# EAGLE design Nexmonitor Invasivo (EAGLE 9.5.0)
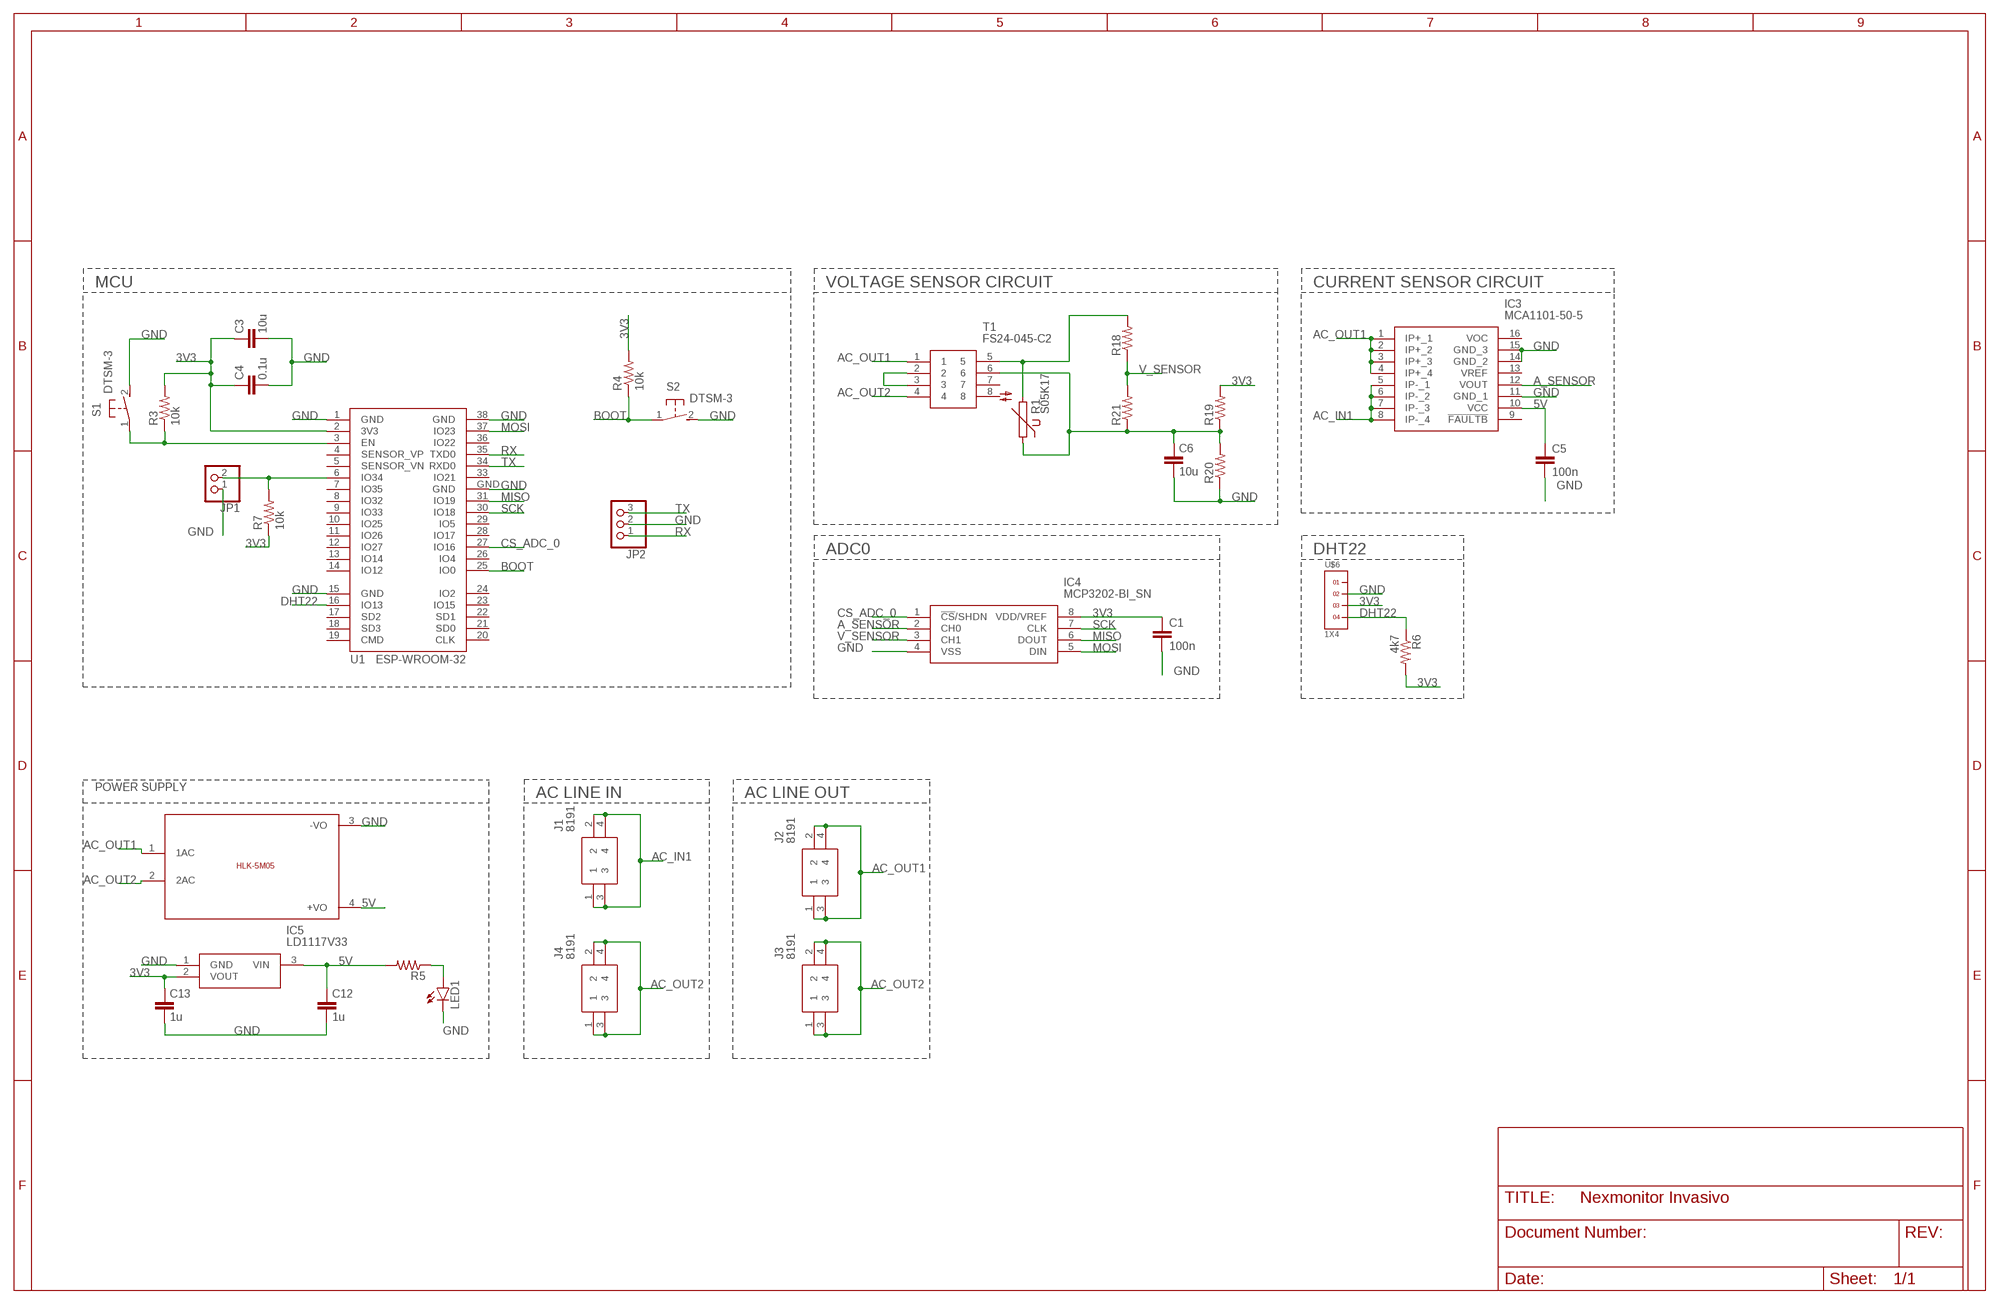
[diagram p0: schematic, sheet 1]

## Parts
C1  100n  C-EUC0805K  [C0805K]
C3  10u  C-EUC0805  [C0805]
C4  0.1u  C-EUC0805  [C0805]
C5  100n  C-EUC0805K  [C0805K]
C6  10u  C-EUC0805  [C0805]
C12  1u  C-EU025-025X050  [C025-025X050]
C13  1u  C-EU025-025X050  [C025-025X050]
IC3  MCA1101-50-5  [SOIC127P1031X264-16N]
IC4  MCP3202-BI_SN  [SOIC127P600X175-8N]
IC5  LD1117V33  [TO270P460X1020X2008-3P]
J1  8191  [8191]
J2  8191  [8191]
J3  8191  [8191]
J4  8191  [8191]
JP1  PINHD-1X2  [1X02]
JP2  PINHD-1X3  [1X03]
LED1  LED5MM  [LED5MM]
R1  S05K17  [S05K17]
R3  10k  R-US_R0805  [R0805]
R4  10k  R-US_R0805  [R0805]
R5  470  R-US_R0805  [R0805]
R6  4k7  R-US_R0805  [R0805]
R7  10k  R-US_R0805  [R0805]
R18  470k  R-US_R0805  [R0805]
R19  120k  R-US_R0805  [R0805]
R20  470k  R-US_R0805  [R0805]
R21  33k  R-US_R0805  [R0805]
S1  DTSM-3  [DTSM-3]
S2  DTSM-3  [DTSM-3]
T1  FS24-045-C2  [FS24045C2]
U1  ESP-WROOM-32  [ESP-WROOM-32]
U$5  5VDC/5W  HLK-5M05  [HLK-5M05]
U$6  1X4  [1X4]

## Nets
3V3: C1.1 C3.1 C4.1 C13.1 IC4.8(VDD/VREF) IC5.2(VOUT) R3.2 R4.2 R6.2 R7.1 R19.2 U1.2(3V3) U$6.3
5V: C5.1 C12.1 IC3.10(VCC) IC5.3(VIN) R5.2 U$5.4(+VO)
A_SENSOR: IC3.12(VOUT) IC4.2(CH0)
AC_IN1: IC3.5(IP-_1) IC3.6(IP-_2) IC3.7(IP-_3) IC3.8(IP-_4) J1.1 J1.2 J1.3 J1.4
AC_OUT1: IC3.1(IP+_1) IC3.2(IP+_2) IC3.3(IP+_3) IC3.4(IP+_4) J2.1 J2.2 J2.3 J2.4 T1.1 U$5.1(1AC)
AC_OUT2: J3.1 J3.2 J3.3 J3.4 J4.1 J4.2 J4.3 J4.4 T1.4 U$5.2(2AC)
BOOT: R4.1 S2.1 U1.25(IO0)
CS_ADC_0: IC4.1(!CS!/SHDN) U1.27(IO16)
DHT22: R6.1 U1.16(IO13) U$6.4
GND: C1.2 C3.2 C4.2 C5.2 C6.2 C12.2 C13.2 IC3.11(GND_1) IC3.14(GND_2) IC3.15(GND_3) IC4.4(VSS) IC5.1(GND) JP1.1 JP2.2 LED1.K(C) R20.1 S1.2 S2.2 U1.1(GND) U1.15(GND) U1.38(GND) U1.GND U$5.3(-VO) U$6.2
MISO: IC4.6(DOUT) U1.31(IO19)
MOSI: IC4.5(DIN) U1.37(IO23)
N$1: R1.2 R18.2 T1.5
N$2: LED1.A R5.1
N$3: T1.2 T1.3
N$4: JP1.2 R7.2 U1.6(IO34)
N$5: R3.1 S1.1 U1.3(EN)
N$12: C6.1 R1.1 R19.1 R20.2 R21.1 T1.6
RX: JP2.1 U1.35(TXD0)
SCK: IC4.7(CLK) U1.30(IO18)
TX: JP2.3 U1.34(RXD0)
V_SENSOR: IC4.3(CH1) R18.1 R21.2
Unconnected: IC3.9(!FAULTB) IC3.13(VREF) IC3.16(VOC) T1.7 T1.8 U1.4(SENSOR_VP) U1.5(SENSOR_VN) U1.7(IO35) U1.8(IO32) U1.9(IO33) U1.10(IO25) U1.11(IO26) U1.12(IO27) U1.13(IO14) U1.14(IO12) U1.17(SD2) U1.18(SD3) U1.19(CMD) U1.20(CLK) U1.21(SD0) U1.22(SD1) U1.23(IO15) U1.24(IO2) U1.26(IO4) U1.28(IO17) U1.29(IO5) U1.33(IO21) U1.36(IO22) U$6.1

## Notes on the sheet
- MCU | VOLTAGE SENSOR CIRCUIT | CURRENT SENSOR CIRCUIT
- ADC0 | DHT22
- POWER SUPPLY
- AC LINE IN | AC LINE OUT

## Library data of the parts
C1 C3-C6 C12 C13 = rcl:C-EU: CAPACITOR, European symbol; SPICEPREFIX: C
IC3 = MCA1101-50-5:MCA1101-50-5: Board Mount Current Sensors High Accuracy 50A Current Sensor, 5V, Fixed gain, 1.5MHz 3dB BW, OCP, Galvanic Isolation. UL/IEC/EN60950-1 and UL1577 certified. SOIC-16 Source: Datasheet <https://componentsearchengine.com/Datasheets/1/MCA1101-50-5.pdf>; DESCRIPTION: Board Mount Current Sensors High Accuracy 50A Current Sensor, 5V, Fixed gain, 1.5MHz 3dB BW, OCP, Galvanic Isolation. UL/IEC/EN60950-1 and UL1577 certified. SOIC-16; HEIGHT: 2.64mm; MANUFACTURER_NAME: ACEINNA; MANUFACTURER_PART_NUMBER: MCA1101-50-5; MOUSER_PART_NUMBER: 438-MCA1101-50-5; MOUSER_PRICE-STOCK: https://www.mouser.com/Search/Refine.aspx?Keyword=438-MCA1101-50-5
IC4 = SamacSys_Parts:MCP3202-BI_SN: IC, A-D, Converter, 12 bit, SMT, MCP3202BISN Source: Datasheet <https://componentsearchengine.com/Datasheets/1/MCP3202-BI_SN.pdf>; DESCRIPTION: IC, A-D, Converter, 12 bit, SMT, MCP3202BISN; HEIGHT: 1.75mm; MANUFACTURER_NAME: Microchip; MANUFACTURER_PART_NUMBER: MCP3202-BI/SN; MOUSER_PART_NUMBER: 579-MCP3202BISN; MOUSER_PRICE-STOCK: https://www.mouser.com/Search/Refine.aspx?Keyword=579-MCP3202BISN
IC5 = SamacSys_Parts:LD1117V33: 800mA,3.3V,LDO Voltage Reg.,LD1117V33 STMicroelectronics LD1117V33, LDO Voltage Regulator, 1.3A, 3.3 V +/-1%, 3-Pin TO-220 Source: Datasheet <https://componentsearchengine.com/Datasheets/1/LD1117V33.pdf>; DESCRIPTION: 800mA,3.3V,LDO Voltage Reg.,LD1117V33 STMicroelectronics LD1117V33, LDO Voltage Regulator, 1.3A, 3.3 V +/-1%, 3-Pin TO-220; HEIGHT: 4.6mm; MANUFACTURER_NAME: STMicroelectronics; MANUFACTURER_PART_NUMBER: LD1117V33; MOUSER_PART_NUMBER: 511-LD1117V33; MOUSER_PRICE-STOCK: https://www.mouser.com/Search/Refine.aspx?Keyword=511-LD1117V33
J1-J4 = SamacSys_Parts:8191: Screw terminal, PC mount, vertical, with screw, metal, 15 Amps Source: Datasheet <https://componentsearchengine.com/Datasheets/1/8191.pdf>; DESCRIPTION: Screw terminal, PC mount, vertical, with screw, metal, 15 Amps; HEIGHT: 6.56mm; MANUFACTURER_NAME: Keystone Electronics; MANUFACTURER_PART_NUMBER: 8191; MOUSER_PART_NUMBER: 534-8191; MOUSER_PRICE-STOCK: https://www.mouser.com/Search/Refine.aspx?Keyword=534-8191
JP1 = pinhead:PINHD-1X2: PIN HEADER
JP2 = pinhead:PINHD-1X3: PIN HEADER
LED1 = led:LED: LED OSRAM: - CHIPLED LG R971, LG N971, LY N971, LG Q971, LY Q971, LO R971, LY R971 LH N974, LH R974 LS Q976, LO Q976, LY Q976 LO Q996 - Hyper CHIPLED LW Q18S LB Q993, LB Q99A, LB R99A - SideLED LS A670, LO A670, LY A670, LG A670, LP A670 LB A673, LV A673, LT A673, LW A673 LH A674 LY A675 LS A676, LA A676, LO A676, LY A676, LW A676 LS A679, LY A679, LG A679 - Hyper Micro SIDELED® LS Y876, LA Y876, LO Y876, LY Y876 LT Y87S - SmartLED LW L88C, LW L88S LB L89C, LB L89S, LG L890 LS L89K, LO L89K, LY L89K LS L896, LA L896, LO L896, LY L896 - TOPLED LS T670, LO T670, LY T670, LG T670, LP T670 LSG T670, LSP T670, LSY T670, LOP T670, LYG T670 LG T671, LOG T671, LSG T671 LB T673, LV T673, LT T673, LW T673 LH T674 LS T676, LA T676, LO T676, LY T676, LB T676, LH T676, LSB T676, LW T676 LB T67C, LV T67C, LT T67C, LS T67K, LO T67K, LY T67K, LW E67C LS E67B, LA E67B, LO E67B, LY E67B, LB E67C, LV E67C, LT E67C LW T67C LS T679, LY T679, LG T679 LS T770, LO T770, LY T770, LG T770, LP T770 LB T773, LV T773, LT T773, LW T773 LH T774 LS E675, LA E675, LY E675, LS T675 LS T776, LA T776, LO T776, LY T776, LB T776 LHGB T686 LT T68C, LB T68C - Hyper Mini TOPLED® LB M676 - Mini TOPLED Santana® LG M470 LS M47K, LO M47K, LY M47K Source: http://www.osram.convergy.de LUXEON: - LUMILED® LXK2-PW12-R00, LXK2-PW12-S00, LXK2-PW14-U00, LXK2-PW14-V00 LXK2-PM12-R00, LXK2-PM12-S00, LXK2-PM14-U00 LXK2-PE12-Q00, LXK2-PE12-R00, LXK2-PE12-S00, LXK2-PE14-T00, LXK2-PE14-U00 LXK2-PB12-K00, LXK2-PB12-L00, LXK2-PB12-M00, LXK2-PB14-N00, LXK2-PB14-P00, LXK2-PB14-Q00 LXK2-PR12-L00, LXK2-PR12-M00, LXK2-PR14-Q00, LXK2-PR14-R00 LXK2-PD12-Q00, LXK2-PD12-R00, LXK2-PD12-S00 LXK2-PH12-R00, LXK2-PH12-S00 LXK2-PL12-P00, LXK2-PL12-Q00, LXK2-PL12-R00 Source: www.luxeon.com KINGBRIGHT: KA-3528ASYC Source: www.kingbright.com
R1 = varistor:S05K17: VARISTOR
R3-R7 R18-R21 = rcl:R-US_: RESISTOR, American symbol; SPICEPREFIX: R
S1 S2 = switch-tact:DTSM-3
T1 = SamacSys_Parts:FS24-045-C2: Power Transformers Power Transformer, PC Mount, Class 2/3, 8Pin, 1.1 V A, 12/24VDC (Nominal Secondary) Output, Primary Input, 24VDC CT at 0.045A Secondary in Series, 12VDC at 0.09A Secondary in Parallel Source: Datasheet <https://componentsearchengine.com/Datasheets/1/FS24-045-C2.pdf>; DESCRIPTION: Power Transformers Power Transformer, PC Mount, Class 2/3, 8Pin, 1.1 V A, 12/24VDC (Nominal Secondary) Output, Primary Input, 24VDC CT at 0.045A Secondary in Series, 12VDC at 0.09A Secondary in Parallel; HEIGHT: 28mm; MANUFACTURER_NAME: Triad Magnetics; MANUFACTURER_PART_NUMBER: FS24-045-C2; MOUSER_PART_NUMBER: 553-FS24-045-C2; MOUSER_PRICE-STOCK: https://www.mouser.com/Search/Refine.aspx?Keyword=553-FS24-045-C2
U1 = esp32:ESP-WROOM-32: Espressif Systems ESP-WROOM-32
U$5 = HLK-5M05:HLK-5M05: HLK-5M05 is an 5Volt/5W smps developed by HI-LINK; SIZE: 23x38(mm)
U$6 = headers(2mm):1X4

## Board
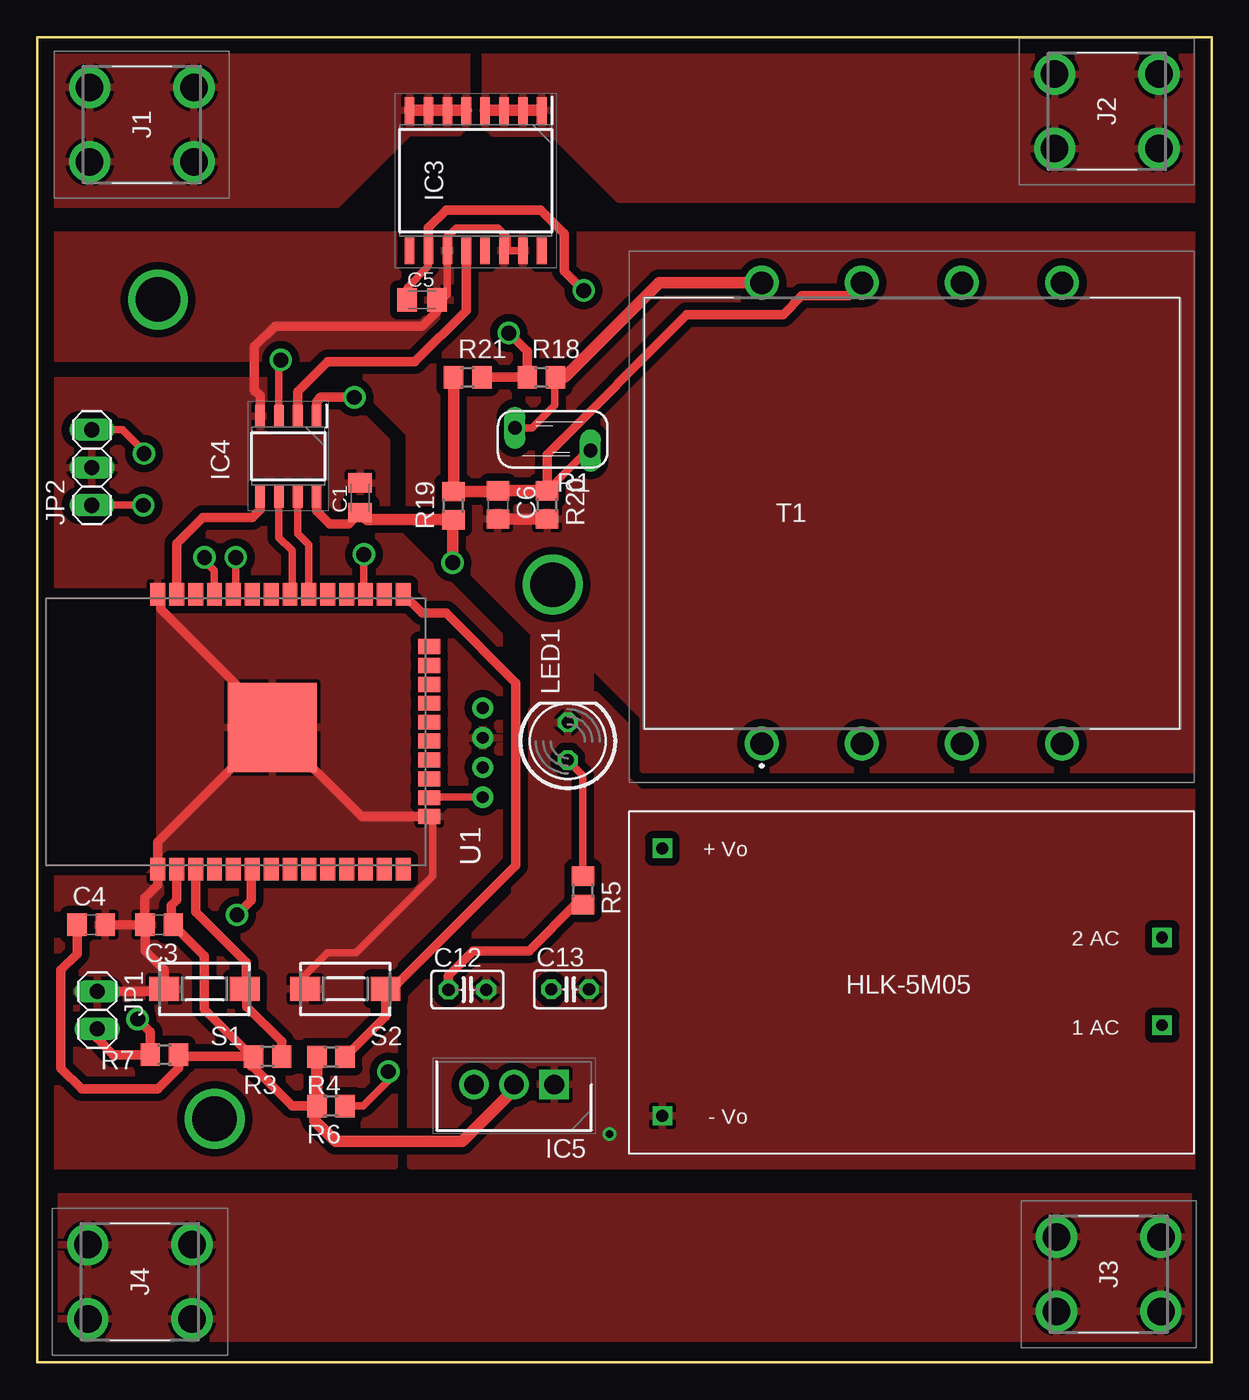
[diagram p1: board, top side]
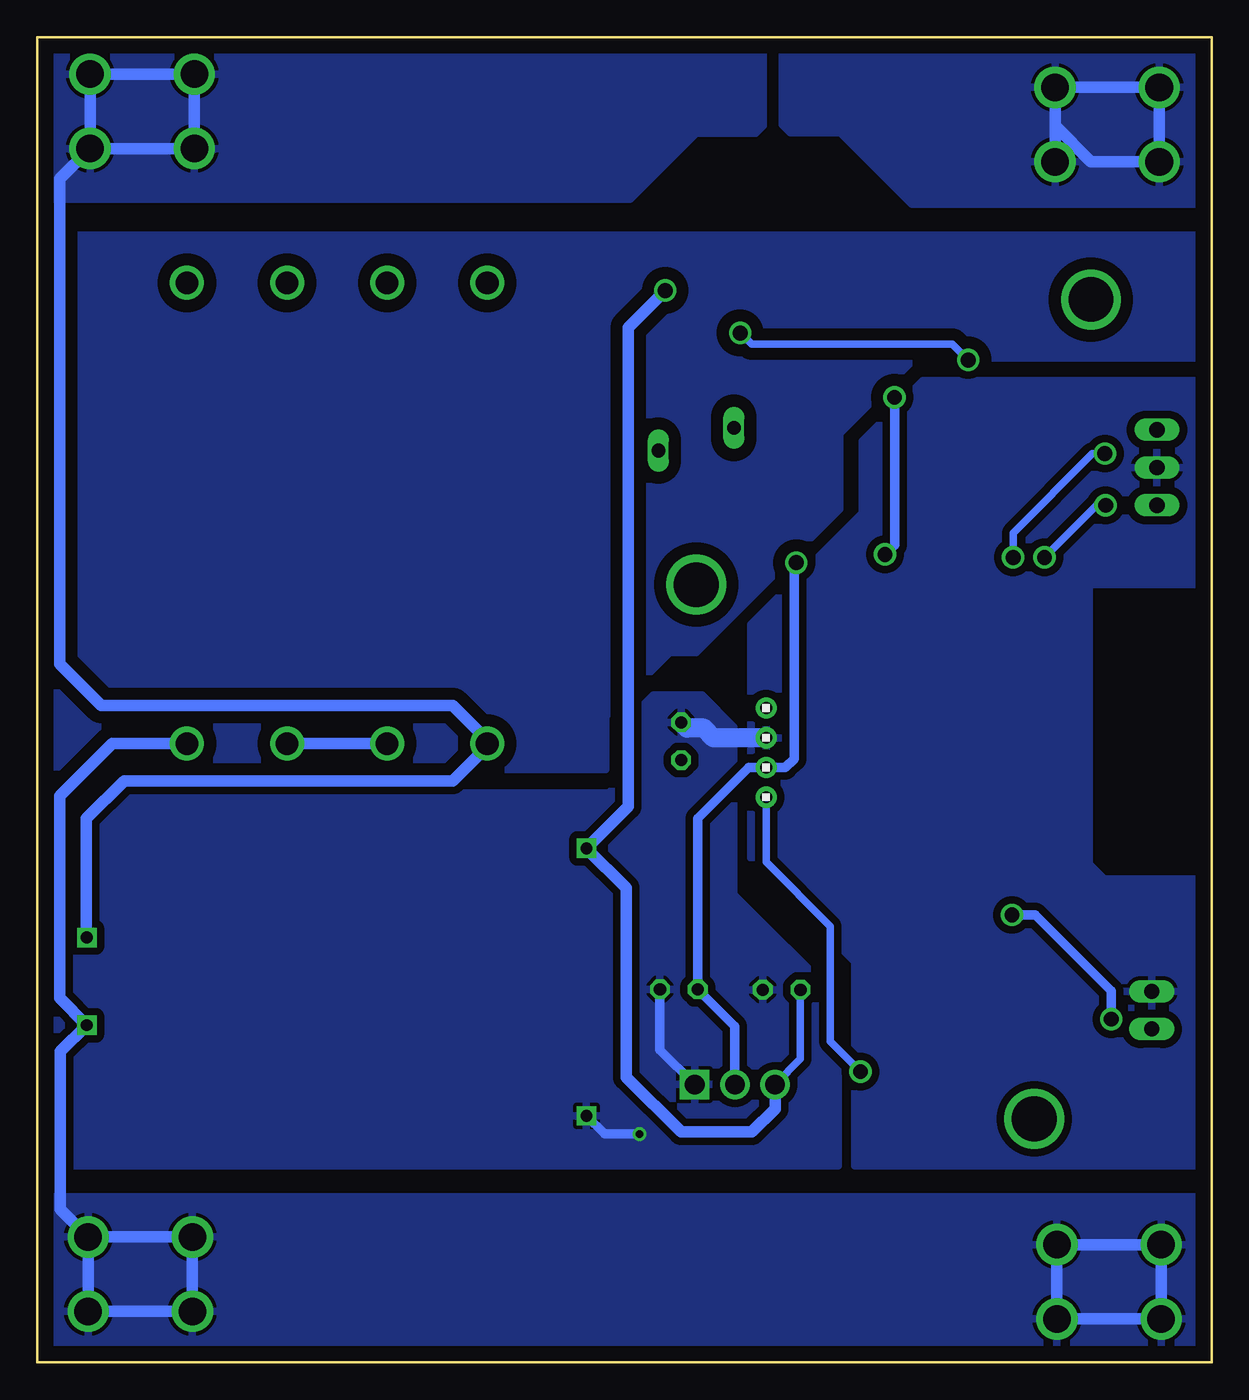
[diagram p2: board, bottom side, seen from below]

Size 78.99 x 89.15 mm. Coordinates in mm from the lower left corner, seen from the top.
Outline: 78.99,0 0,0 0,89.15 78.99,89.15 78.99,0
Copper layers (1*16): Top 0.035mm / dielectric 1.5mm / Bottom 0.035mm
Design rules "default *": minimum track width 10mil, minimum drill 0.5mm, track to track 10mil, track to pad 10mil, pad to pad 10mil, via to via 10mil, smd to smd 10mil, copper to edge 40mil, drill to drill 10mil, minimum pad ring 10mil, minimum via ring 8mil, stop-mask expansion 4mil, vias tented up to drill 0mil, thermal gap 10mil

### Footprints (pad centres in the part's own frame; a part is rotated, then mirrored left to right if it is on the bottom)
C0805K = smd 1.3 x 1.6: 1 -1,0; 2 1,0
C0805 = smd 1.3 x 1.5: 1 -0.95,0; 2 0.95,0
C025-025X050 = drill 0.813 octagon: 1 -1.27,0; 2 1.27,0
SOIC127P1031X264-16N = smd 1.8 x 0.65: 1 -4.725,4.445; 2 -4.725,3.175; 3 -4.725,1.905; 4 -4.725,0.635; 5 -4.725,-0.635; 6 -4.725,-1.905; 7 -4.725,-3.175; 8 -4.725,-4.445; 9 4.725,-4.445; 10 4.725,-3.175; 11 4.725,-1.905; 12 4.725,-0.635; 13 4.725,0.635; 14 4.725,1.905; 15 4.725,3.175; 16 4.725,4.445
SOIC127P600X175-8N = smd 1.5 x 0.65: 1 -2.7,1.905; 2 -2.7,0.635; 3 -2.7,-0.635; 4 -2.7,-1.905; 5 2.7,-1.905; 6 2.7,-0.635; 7 2.7,0.635; 8 2.7,1.905
TO270P460X1020X2008-3P = drill 1.32 pad 1.98 square: 1 0,0 | drill 1.32 pad 1.98: 2 2.7,0; 3 5.4,0
8191 = drill 1.85 pad 2.775: 1 0,0; 2 5,0; 3 5,7.01; 4 0,7.01
1X02 = drill 1.016 long: 1 -1.27,0; 2 1.27,0
1X03 = drill 1.016 long: 1 -2.54,0; 2 0,0; 3 2.54,0
LED5MM = drill 0.813 octagon: A -1.27,0; K 1.27,0
S05K17 = drill 0.914 long: 1 -0.762,-2.54; 2 0.762,2.54
R0805 = smd 1.3 x 1.5: 1 -0.95,0; 2 0.95,0
DTSM-3 = smd 2 x 1.6: 1 -2.7,0; 2 2.7,0
FS24045C2 = drill 1.524 pad 2.286: 1 -10.096,-15.272; 2 -3.365,-15.272; 3 3.365,-15.272; 4 10.096,-15.272; 5 -10.096,15.729; 6 -3.365,15.729; 7 3.365,15.729; 8 10.096,15.729
ESP-WROOM-32 = smd 1.5 x 1: 1 -9.25,7; 2 -9.25,5.73; 3 -9.25,4.46; 4 -9.25,3.19; 5 -9.25,1.92; 6 -9.25,0.65; 7 -9.25,-0.62; 8 -9.25,-1.89; 9 -9.25,-3.16; 10 -9.25,-4.43; 11 -9.25,-5.7; 12 -9.25,-6.97; 13 -9.25,-8.24; 14 -9.25,-9.51; 25 9.25,-9.51; 26 9.25,-8.24; 27 9.25,-6.97; 28 9.25,-5.7; 29 9.25,-4.43; 30 9.25,-3.16; 31 9.25,-1.89; 32 9.25,-0.62; 33 9.25,0.65; 34 9.25,1.92; 35 9.25,3.19; 36 9.25,4.46; 37 9.25,5.73; 38 9.25,7 | smd 1 x 1.5: 15 -5.7,-11.25; 16 -4.43,-11.25; 17 -3.16,-11.25; 18 -1.89,-11.25; 19 -0.62,-11.25; 20 0.65,-11.25; 21 1.92,-11.25; 22 3.19,-11.25; 23 4.46,-11.25; 24 5.73,-11.25 | smd 6 x 6: GND 0.3,-0.7
HLK-5M05 = drill 0.8 square: 1 -16.85,-2.93; 2 -16.85,2.97; 3 16.75,9.07; 4 16.75,-8.93
1X4 = drill 0.8 pad 1.422: 1 -3,0; 2 -1,0; 3 1,0; 4 3,0

### Placement (x,y rotation side)
C1  21.72,58.17 90 top
C3  8.2,29.44 180 top
C4  3.63,29.44 0 top
C5  25.88,71.48 0 top
C6  30.99,57.68 270 top
C12  28.93,25.07 0 top
C13  35.84,25.1 0 top
IC3  29.49,79.5 270 top
IC4  16.89,60.96 270 top
IC5  34.77,18.69 180 top
J1  10.54,80.77 90 top
J2  75.44,81.66 90 top
J3  75.57,3.43 90 top
J4  10.41,2.92 90 top
JP1  4.04,23.7 270 top
JP2  3.68,60.2 90 top
LED1  35.69,41.78 90 top
R1  34.67,62.1 90 top
R3  15.49,20.57 180 top
R4  19.76,20.55 180 top
R5  36.7,31.75 270 top
R6  19.76,17.25 180 top
R7  8.56,20.7 180 top
R18  33.91,66.27 0 top
R19  27.99,57.63 270 top
R20  34.29,57.68 90 top
R21  28.96,66.27 0 top
S1  11.25,25.12 180 top
S2  20.73,25.12 180 top
T1  58.83,56.9 0 top
U1  15.11,42.42 90 top
U$5  58.8,25.65 180 top
U$6  29.97,41.02 270 bottom

### Tracks (layer width: path | path; a pad name or v marks a point on that pad's centre or on a via)
3V3  (via drill 1)
  Top 0.508: 27.94,56.63 R19.2
  Top 0.635: C4.1 2.68,27.47 1.6,26.39 1.6,19.79 3,18.39 8.1,18.39 9.51,19.8 R7.1 9.64,20.57 14.43,20.57 11.25,23.75 11.25,27.34 C3.1 9.02,29.58 9.02,30.73 9.38,31.1 U1.2 | C1.1 20.94,56.39 19.69,56.39 18.8,57.28 IC4.8 | R6.2 17.17,17.25 14.43,19.99
  Top 0.762: R3.2 14.43,20.57 14.43,19.99 | v27.94,53.8 27.94,56.63 | C1.1 22.2,56.68 R19.2 | IC5.2 32.07,18.36 28.58,14.86 20.07,14.86 18.67,16.26 18.67,17.1 R6.2 R4.2
  Bottom 0.635: 28.09,53.64 28.09,40.6 28.68,40.02 U$6.3 31.12,40.02 34.57,36.58 C13.1 32.07,22.6 IC5.2
  Bottom 0.762: v27.94,53.8 28.09,53.64
5V  (via drill 1)
  Top 0.508: IC3.10 26.31,73.74 24.88,72.3 C5.1
  Top 0.635: IC3.10 26.31,76.33 27.51,77.52 33.88,77.52 35.46,75.95 35.46,73.41 v36.75,72.11 | R5.2 36.19,30.8 33.08,27.69 29.34,27.69 27.66,26.01 C12.1
  Bottom 0.508: C12.1 27.66,20.41 IC5.3
  Bottom 0.762: v36.75,72.11 39.24,69.62 39.24,37.39 U$5.4 39.37,31.9 39.37,19.18 35.69,15.49 30.92,15.49 29.37,17.04 IC5.3
A_SENSOR
  Top 0.635: IC3.12 28.85,70.76 25.4,67.31 19.53,67.31 17.53,65.3 IC4.2
AC_IN1
  Top 0.762: IC3.8 IC3.7 IC3.6 IC3.5
  Bottom 0.762: J1.1 10.54,83.19 | 10.54,83.19 J1.2 J1.3 J1.4 8.13,80.77 10.54,83.19
  pour Top: 0.89,88.52 0.89,77.93 20.19,77.93 24.99,82.73 28.35,82.73 28.88,83.26 28.88,88.52
  pour Bottom: 0.89,88.52 0.89,77.93 20.19,77.93 24.99,82.73 28.35,82.73 28.88,83.26 28.88,88.52
AC_OUT1
  Top 0.762: IC3.4 IC3.3 IC3.2 IC3.1
  Bottom 0.762: U$5.1 75.69,28.62 75.69,36.58 73.15,39.12 51.05,39.12 48.73,41.44 T1.1 48.73,41.87 51.05,44.2 74.68,44.2 77.47,46.99 77.47,79.63 J2.1 | J2.1 J2.2 J2.3 J2.4 J2.1
  pour Top: 30.15,88.62 30.15,83.21 30.66,82.7 34.67,82.7 39.12,78.26 78.84,78.26 78.84,88.62
  pour Bottom: 30.15,88.62 30.15,83.21 30.66,82.7 34.67,82.7 39.12,78.26 78.84,78.26 78.84,88.62
AC_OUT2
  Bottom 0.762: T1.4 73.95,41.62 77.47,38.1 77.47,24.5 U$5.2 77.43,20.91 77.43,10.29 J3.2 | J3.2 J3.1 J3.4 J3.3 J3.2 | J4.4 J4.3 J4.2 J4.1 J4.4
  pour Top (isolate 1.27): 0.86,0.56 0.86,11.13 78.82,11.13 78.82,0.56
  pour Bottom: 0.86,0.56 0.86,11.13 78.82,11.13 78.82,0.56
BOOT
  Top 0.635: U1.25 25.89,50.4 27.5,50.4 32.18,45.72 32.18,33.42 23.88,25.12 S2.1 23.43,23.26 R4.1
CS_ADC_0  (via drill 1)
  Top 0.508: U1.27 21.97,51.78 v21.97,54.36
  Top 0.635: IC4.1 18.8,64.64 19.08,64.92 v21.34,64.92
  Bottom 0.635: v21.97,54.36 21.34,54.99 v21.34,64.92
DHT22  (via drill 1)
  Top 0.508: U1.16 26.4,38.02 U$6.4 | R6.1 21.95,17.25 23.62,18.92 v23.62,19.56
  Bottom 0.508: v23.62,19.56 25.65,21.59 25.65,29.34 29.97,33.66 U$6.4
GND  (via drill 0.5)
  Top 0.508: U1.15 26.62,36.46 26.62,32.74 21.41,27.53 19.51,27.53 18.03,26.05 S2.2 | IC3.15 IC3.14 31.62,75.01 31.62,75.69 31.01,76.3 28.17,76.3 27.58,75.72 IC3.11 27.58,71.85 27.21,71.48 C5.2
  Top 0.635: JP1.1 8.2,24.97 8.55,24.61 S1.2 8.55,26.39 7.25,27.69 C3.2 | U1.GND 21.81,36.72 U1.15 | U1.38 8.31,51.47 8.31,50.68 15.81,43.18 U1.GND | U1.GND 8.11,35.02 U1.1 8.11,32.12 7.24,31.24 7.24,29.45 C3.2 | C4.2 C3.2 | C5.2 26.88,70.7 25.91,69.72 16,69.72 14.61,68.33 14.61,65.41 14.99,65.02 IC4.4
  Top 0.762: C6.2 R20.1
  Bottom 0.635: C13.2 37.11,21.03 IC5.1 | U$5.3 40.83,15.37 v38.48,15.37
  Bottom 1.27: U$6.2 33.51,42.02 34.16,42.67 35.31,42.67 LED1.K
  pour Top (isolate 0.508): 78.79,13.23 78.79,38.35 40.51,38.35 39.6,39.27 39.6,42.85 37.57,44.88 34.26,44.88 32.13,42.75 32.13,31.5 25.12,24.49 25.12,13.23
  pour Bottom (isolate 0.508): 0.89,13.21 24,13.21 24,26.92 31.01,33.93 31.01,49.63 23.5,57.15 23.5,61.98 19.43,66.04 1.02,66.04 0.89,65.91 0.89,52.45 1.02,52.32 8.25,52.32 8.25,33.53 7.24,32.51 0.89,32.51
  pour Top (isolate 0.508): 78.82,39.88 78.82,75.84 1.07,75.84 1.07,67.56 19.94,67.56 25.02,62.48 25.02,57.4 34.67,47.75 36.45,47.75 40.77,43.43 40.77,39.88
  pour Bottom (isolate 0.813): 78.82,39.88 78.82,75.84 0.94,75.84 0.94,67.56 19.94,67.56 25.02,62.48 25.02,57.4 34.67,47.75 36.45,47.75 40.77,43.43 40.77,39.88
  pour Top (isolate 0.508): 0.91,13.21 24,13.21 24,26.92 31.06,33.99 31.06,48.95 23.5,56.52 23.5,61.98 19.43,66.04 1.02,66.04 0.89,65.91 0.89,52.45 1.02,52.32 8.25,52.32 8.25,33.53 7.24,32.51 0.91,32.51
  pour Top: 33.4,42.67 33.4,48.77 37.21,48.77 37.21,42.67
  pour Bottom (isolate 0.508): 78.77,13.23 78.77,38.3 40.56,38.3 39.6,39.27 39.6,42.85 37.57,44.88 34.26,44.88 32.13,42.75 32.13,31.5 25.12,24.49 25.12,13.23
MISO
  Top 0.508: IC4.6 16.26,55.5 17.14,54.61 17.14,51.81 U1.31
MOSI
  Top 0.508: IC4.5 14.99,57.38
  Top 0.635: 14.99,57.38 14.45,56.84 11.15,56.84 9.38,55.08 U1.37
N$1
  Top 0.508: R1.2 33.27,62.87 34.8,64.39 34.8,66.21 R18.2
  Top 0.762: T1.5 41.85,72.62 35.49,66.27 R18.2
N$2
  Top 0.508: LED1.A 36.7,39.5 R5.1
N$3
  Bottom 0.762: T1.2 T1.3
N$4  (via drill 1)
  Top 0.635: U1.6 14.41,33.12 14.41,31.07 v13.44,30.1 | v6.76,23.09 7.61,22.23 R7.2 5.12,20.7 4.04,21.78 JP1.2
  Bottom 0.635: v13.44,30.1 11.86,30.1 6.76,24.99 v6.76,23.09
N$5
  Top 0.635: R3.1 16.44,21.59 14.11,23.93 14.11,24.97 S1.1 14.05,25.21 14.05,26.9 10.65,30.29 U1.3
N$6  (via drill 3)
  other vias: 8.13,71.5
N$7  (via drill 3)
  other vias: 11.94,16.38
N$8  (via drill 3)
  other vias: 34.67,52.32
N$12
  Top 0.508: T1.6 54.59,71.75 | R20.2 37,61.34 R1.1
  Top 0.635: R20.2 34.29,61.09 43.69,70.48 50.16,70.48 51.44,71.75 54.59,71.75
  Top 0.762: R20.2 C6.1 30.94,58.58 R19.1 28.01,58.6 R21.1
RX  (via drill 1)
  Top 0.508: JP2.1 v7.14,57.66 | v11.25,54.15 11.25,53.92 11.92,53.25 U1.35
  Bottom 0.508: v7.14,57.66 7.75,57.66 v11.25,54.15
SCK
  Top 0.508: IC4.7 17.53,55.75 18.27,55.01 U1.30
TX  (via drill 1)
  Top 0.508: JP2.3 5.72,62.74 7.19,61.27 v7.19,61.14 | v13.36,54.15 13.36,51.83 U1.34
  Bottom 0.508: v7.19,61.14 8.03,61.14 13.36,55.8 v13.36,54.15
V_SENSOR  (via drill 1)
  Top 0.508: IC4.3 16.26,67.31 v16.38,67.44
  Top 0.635: R21.2 R18.1 32.96,68.05 31.75,69.25 v31.71,69.25
  Bottom 0.508: v16.38,67.44 17.44,68.49 30.95,68.49 v31.71,69.25